# EAGLE schematic emonTx4-CTExt (EAGLE 9.6.2)
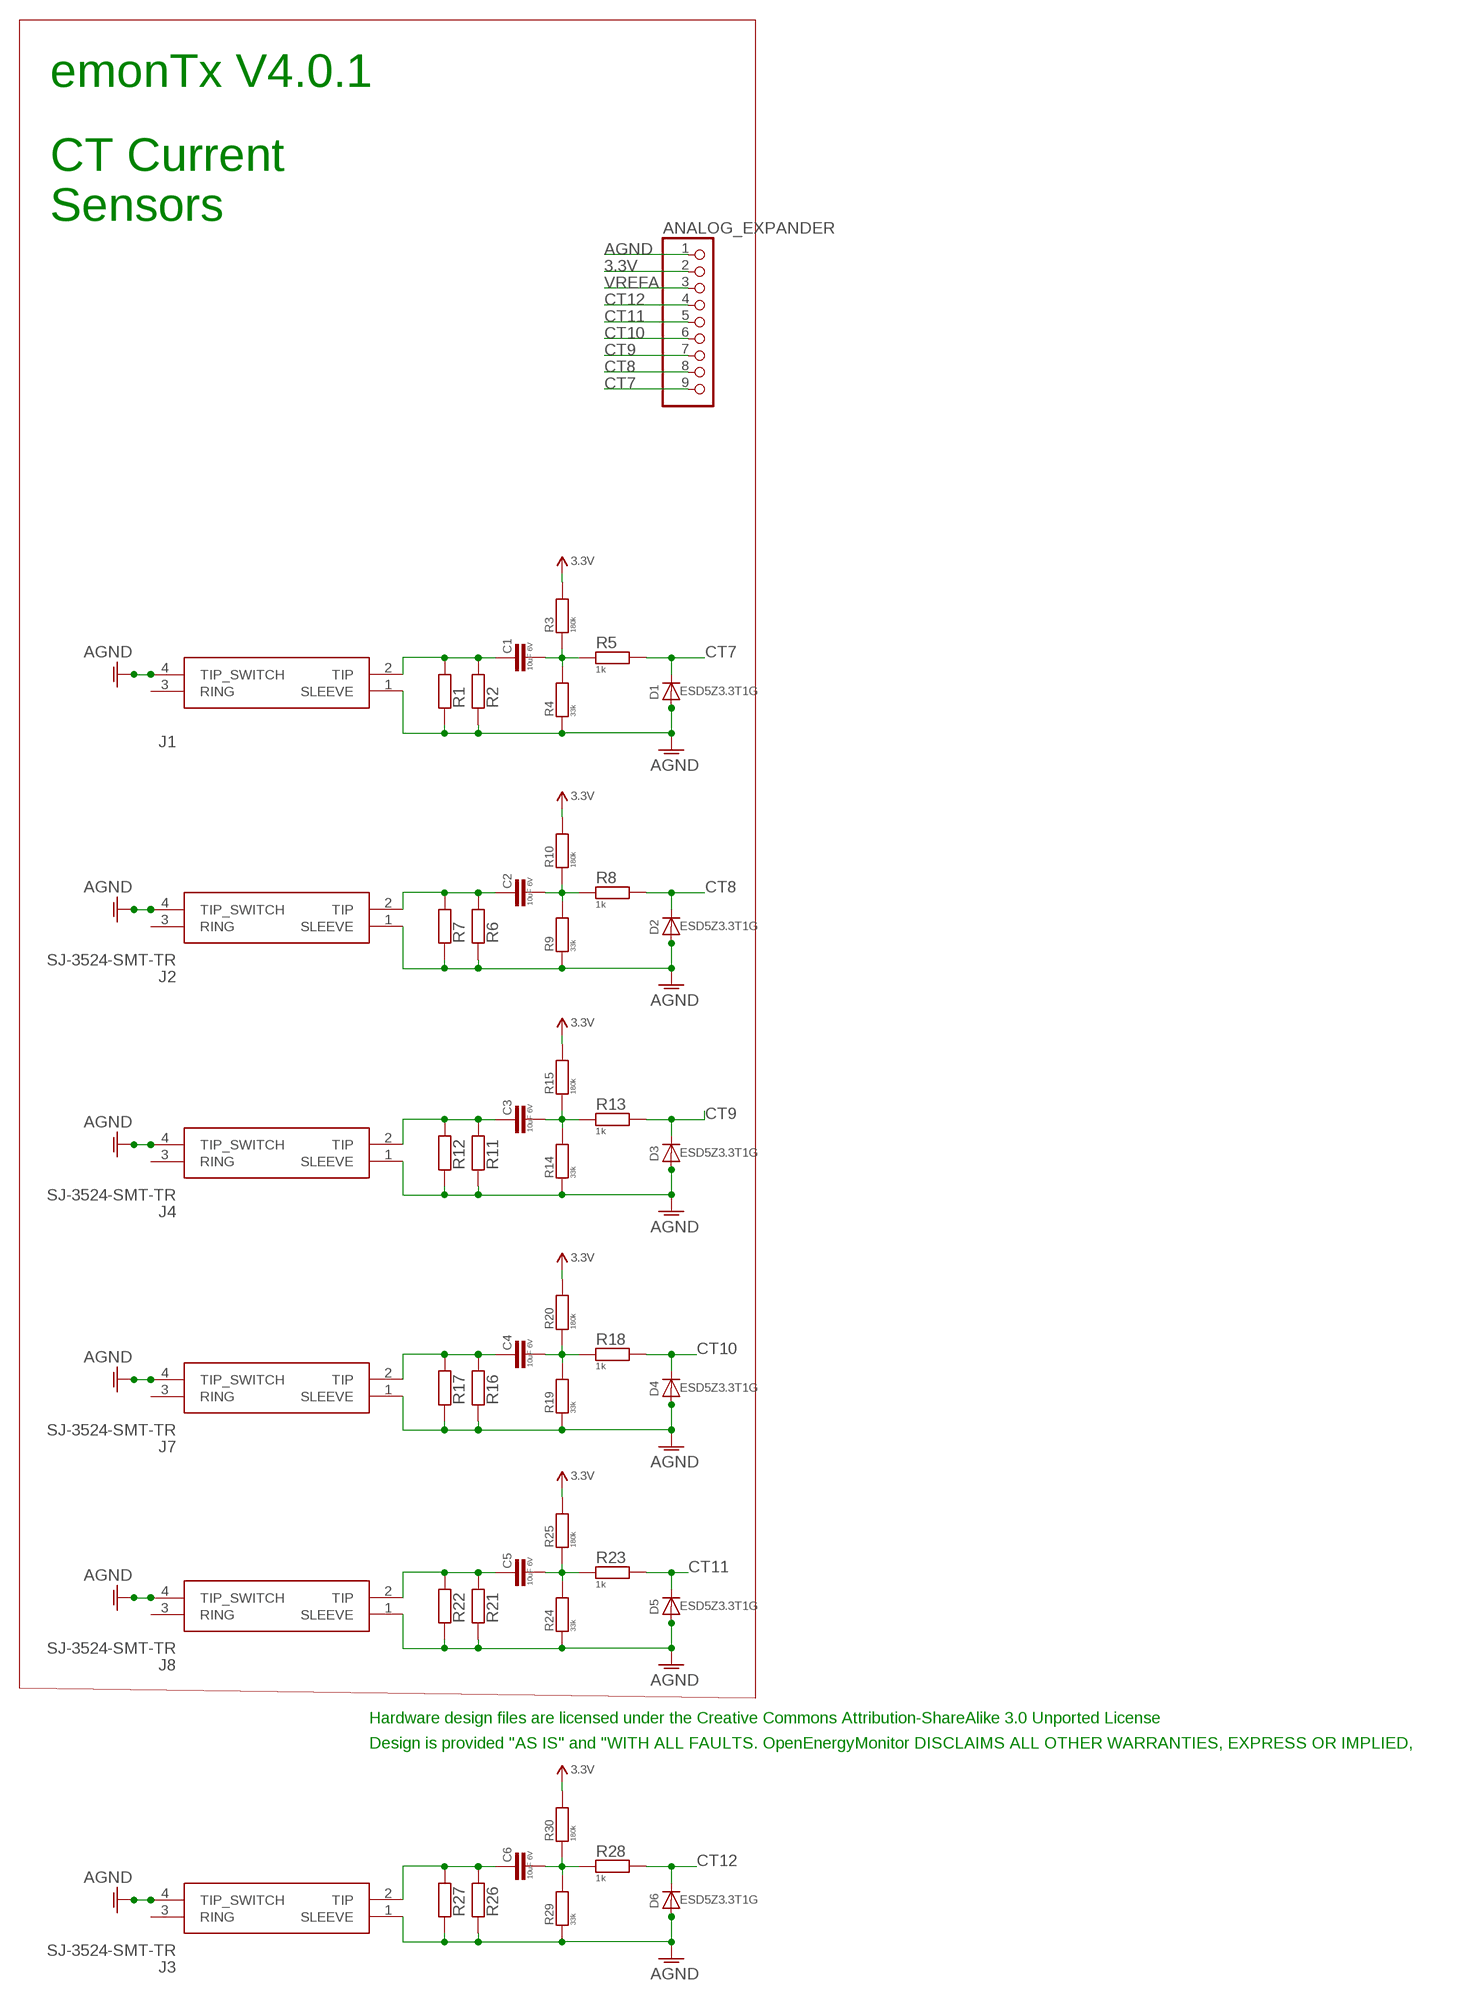
[diagram p0: schematic, sheet 1]

## Parts
ANALOG_EXPANDER  PINHD-1X9  [1X09-BIG]
C1  10uF 6V  C-EUC0603  [C0603]
C2  10uF 6V  C-EUC0603  [C0603]
C3  10uF 6V  C-EUC0603  [C0603]
C4  10uF 6V  C-EUC0603  [C0603]
C5  10uF 6V  C-EUC0603  [C0603]
C6  10uF 6V  C-EUC0603  [C0603]
D1  ESD5Z3.3T1G  DIODESOD-523  [SOD-523]
D2  ESD5Z3.3T1G  DIODESOD-523  [SOD-523]
D3  ESD5Z3.3T1G  DIODESOD-523  [SOD-523]
D4  ESD5Z3.3T1G  DIODESOD-523  [SOD-523]
D5  ESD5Z3.3T1G  DIODESOD-523  [SOD-523]
D6  ESD5Z3.3T1G  DIODESOD-523  [SOD-523]
J1  SJ-3524-SMT-TR  [SJ-3524-SMT-TR]
J2  SJ-3524-SMT-TR  [SJ-3524-SMT-TR]
J3  SJ-3524-SMT-TR  [SJ-3524-SMT-TR]
J4  SJ-3524-SMT-TR  [SJ-3524-SMT-TR]
J7  SJ-3524-SMT-TR  [SJ-3524-SMT-TR]
J8  SJ-3524-SMT-TR  [SJ-3524-SMT-TR]
R1  R-EU_R1206  [R1206]
R2  R-EU_0204/7  [0204/7]
R3  180k  R-EU_R0603  [R0603]
R4  33k  R-EU_R0603  [R0603]
R5  1k  R-EU_R0603  [R0603]
R6  R-EU_0204/7  [0204/7]
R7  R-EU_R1206  [R1206]
R8  1k  R-EU_R0603  [R0603]
R9  33k  R-EU_R0603  [R0603]
R10  180k  R-EU_R0603  [R0603]
R11  R-EU_0204/7  [0204/7]
R12  R-EU_R1206  [R1206]
R13  1k  R-EU_R0603  [R0603]
R14  33k  R-EU_R0603  [R0603]
R15  180k  R-EU_R0603  [R0603]
R16  R-EU_0204/7  [0204/7]
R17  R-EU_R1206  [R1206]
R18  1k  R-EU_R0603  [R0603]
R19  33k  R-EU_R0603  [R0603]
R20  180k  R-EU_R0603  [R0603]
R21  R-EU_0204/7  [0204/7]
R22  R-EU_R1206  [R1206]
R23  1k  R-EU_R0603  [R0603]
R24  33k  R-EU_R0603  [R0603]
R25  180k  R-EU_R0603  [R0603]
R26  R-EU_0204/7  [0204/7]
R27  R-EU_R1206  [R1206]
R28  1k  R-EU_R0603  [R0603]
R29  33k  R-EU_R0603  [R0603]
R30  180k  R-EU_R0603  [R0603]

## Nets
3.3V: ANALOG_EXPANDER.2 R3.2 R10.2 R15.2 R20.2 R25.2 R30.2
AGND [gnd]: ANALOG_EXPANDER.1 D1.A D2.A D3.A D4.A D5.A D6.A J1.1(SLEEVE) J1.4(TIP_SWITCH) J2.1(SLEEVE) J2.4(TIP_SWITCH) J3.1(SLEEVE) J3.4(TIP_SWITCH) J4.1(SLEEVE) J4.4(TIP_SWITCH) J7.1(SLEEVE) J7.4(TIP_SWITCH) J8.1(SLEEVE) J8.4(TIP_SWITCH) R1.1 R2.1 R4.2 R6.1 R7.1 R9.2 R11.1 R12.1 R14.2 R16.1 R17.1 R19.2 R21.1 R22.1 R24.2 R26.1 R27.1 R29.2
CT7: ANALOG_EXPANDER.9 D1.K(C) R5.2
CT8: ANALOG_EXPANDER.8 D2.K(C) R8.2
CT9: ANALOG_EXPANDER.7 D3.K(C) R13.2
CT10: ANALOG_EXPANDER.6 D4.K(C) R18.2
CT11: ANALOG_EXPANDER.5 D5.K(C) R23.2
CT12: ANALOG_EXPANDER.4 D6.K(C) R28.2
N$1: C2.1 J2.2(TIP) R6.2 R7.2
N$2: C2.2 R8.1 R9.1 R10.1
N$3: C3.1 J4.2(TIP) R11.2 R12.2
N$4: C3.2 R13.1 R14.1 R15.1
N$5: C4.1 J7.2(TIP) R16.2 R17.2
N$6: C4.2 R18.1 R19.1 R20.1
N$7: C5.1 J8.2(TIP) R21.2 R22.2
N$8: C5.2 R23.1 R24.1 R25.1
N$9: C6.1 J3.2(TIP) R26.2 R27.2
N$10: C6.2 R28.1 R29.1 R30.1
N$11: C1.2 R3.1 R4.1 R5.1
N$13: C1.1 J1.2(TIP) R1.2 R2.2
VREFA: ANALOG_EXPANDER.3
Unconnected: J1.3(RING) J2.3(RING) J3.3(RING) J4.3(RING) J7.3(RING) J8.3(RING)

## Notes on the sheet
- emonTx V4.0.1
- CT Current 
  Sensors
- Hardware design files are licensed under the Creative Commons Attribution-ShareAlike 3.0 Unported License
- Design is provided "AS IS" and "WITH ALL FAULTS. OpenEnergyMonitor DISCLAIMS ALL OTHER WARRANTIES, EXPRESS OR IMPLIED,

## Library data of the parts
ANALOG_EXPANDER = adafruit:PINHD-1X9: Pin header 1x10 0.1" spacing With round pins
C1-C6 = resistor:C-EU: CAPACITOR, European symbol
D1-D6 = microbuilder:DIODE: Diode SMA Model Volts Amps Type Vf Vr Digikey # Notes SSA34-E3 40V 3A Schottky 480mV @ 3A 200uA @ 40V SSA34-E3/61TGITR-ND CDBA120-G 20V 1A Schottky 500mV @ 1A 500uA @ 20V 641-1014-6-ND REEL MBRA210 10V 2A Schottky 350mV @ 2A 700uA @ 10V MBRA210LT3 SOD-123 Model Volts Amps Type Vf Vr Order # Notes BAT54T1G 30V 200mA Schottky 800mV @ 200mA 2uA @ 25V BAT54T1GOSTR-ND B0530W 30V 500mA Schottky 430mV @ 500mA 130uA @ 30V B0530W-FDICT-ND REEL MBR120 1A 20V Schottky 340mV @ 1A MBR120VLSFT1GOSCT-ND SOD-323 Model Volts Amps Type Vf Vr Order # Notes PMEG2005EJ 20V 500mA Schottky 355mV @ 500mA 568-4110-1-ND ZLLS410 10V 570mA Schottky 380mV @ 570mA ZLLS410CT-ND 1N4148WS 75V 150mA Silicon/Simple 1V 1N4148WSFSCT-ND REEL SOD-523 Model Volts Amps Type Vf Vr Order # Notes BAT54XV2 30V 200mA Schottky 0.8V @ 100mA BAT54XV2CT-ND TB751S 30V 30mA Schottky RB751S-40TE61CT-ND SOT23-R/W (R = Solder Paste/Reflow Ovens, W = Hand-Soldering) Model Volts Amps Type Vf Vr Order # Notes BAT54FILM 40V 300mA Schottky 497-7162-1-ND
J1-J4 J7 J8 = SJ-3524-SMT-TR:SJ-3524-SMT-TR: Phone Connectors Audio Jacks Source: Datasheet <https://datasheet.datasheetarchive.com/originals/distributors/Datasheets-DGA1/151896.pdf>; ARROW_PART_NUMBER: SJ-3524-SMT-TR; ARROW_PRICE-STOCK: https://www.arrow.com/en/products/sj-3524-smt-tr/cui-devices?region=nac; DESCRIPTION: Phone Connectors Audio Jacks; HEIGHT: mm; MANUFACTURER_NAME: CUI Inc.; MANUFACTURER_PART_NUMBER: SJ-3524-SMT-TR; MOUSER_PART_NUMBER: 490-SJ-3524-SMT-TR; MOUSER_PRICE-STOCK: https://www.mouser.co.uk/ProductDetail/CUI-Devices/SJ-3524-SMT-TR?qs=WyjlAZoYn50%252B7OcNbxvx%252BA%3D%3D
R1-R30 = rcl:R-EU_: RESISTOR, European symbol

## Net classes
0 default: width 0.203 mm, drill 0.6 mm, clearance 0.203 mm
1 power: width 0.305 mm, drill 0.6 mm, clearance 0.254 mm
2 gnd: width 0.254 mm, drill 0.6 mm, clearance 0.254 mm